# EAGLE design radar1 (EAGLE 8.7.1)
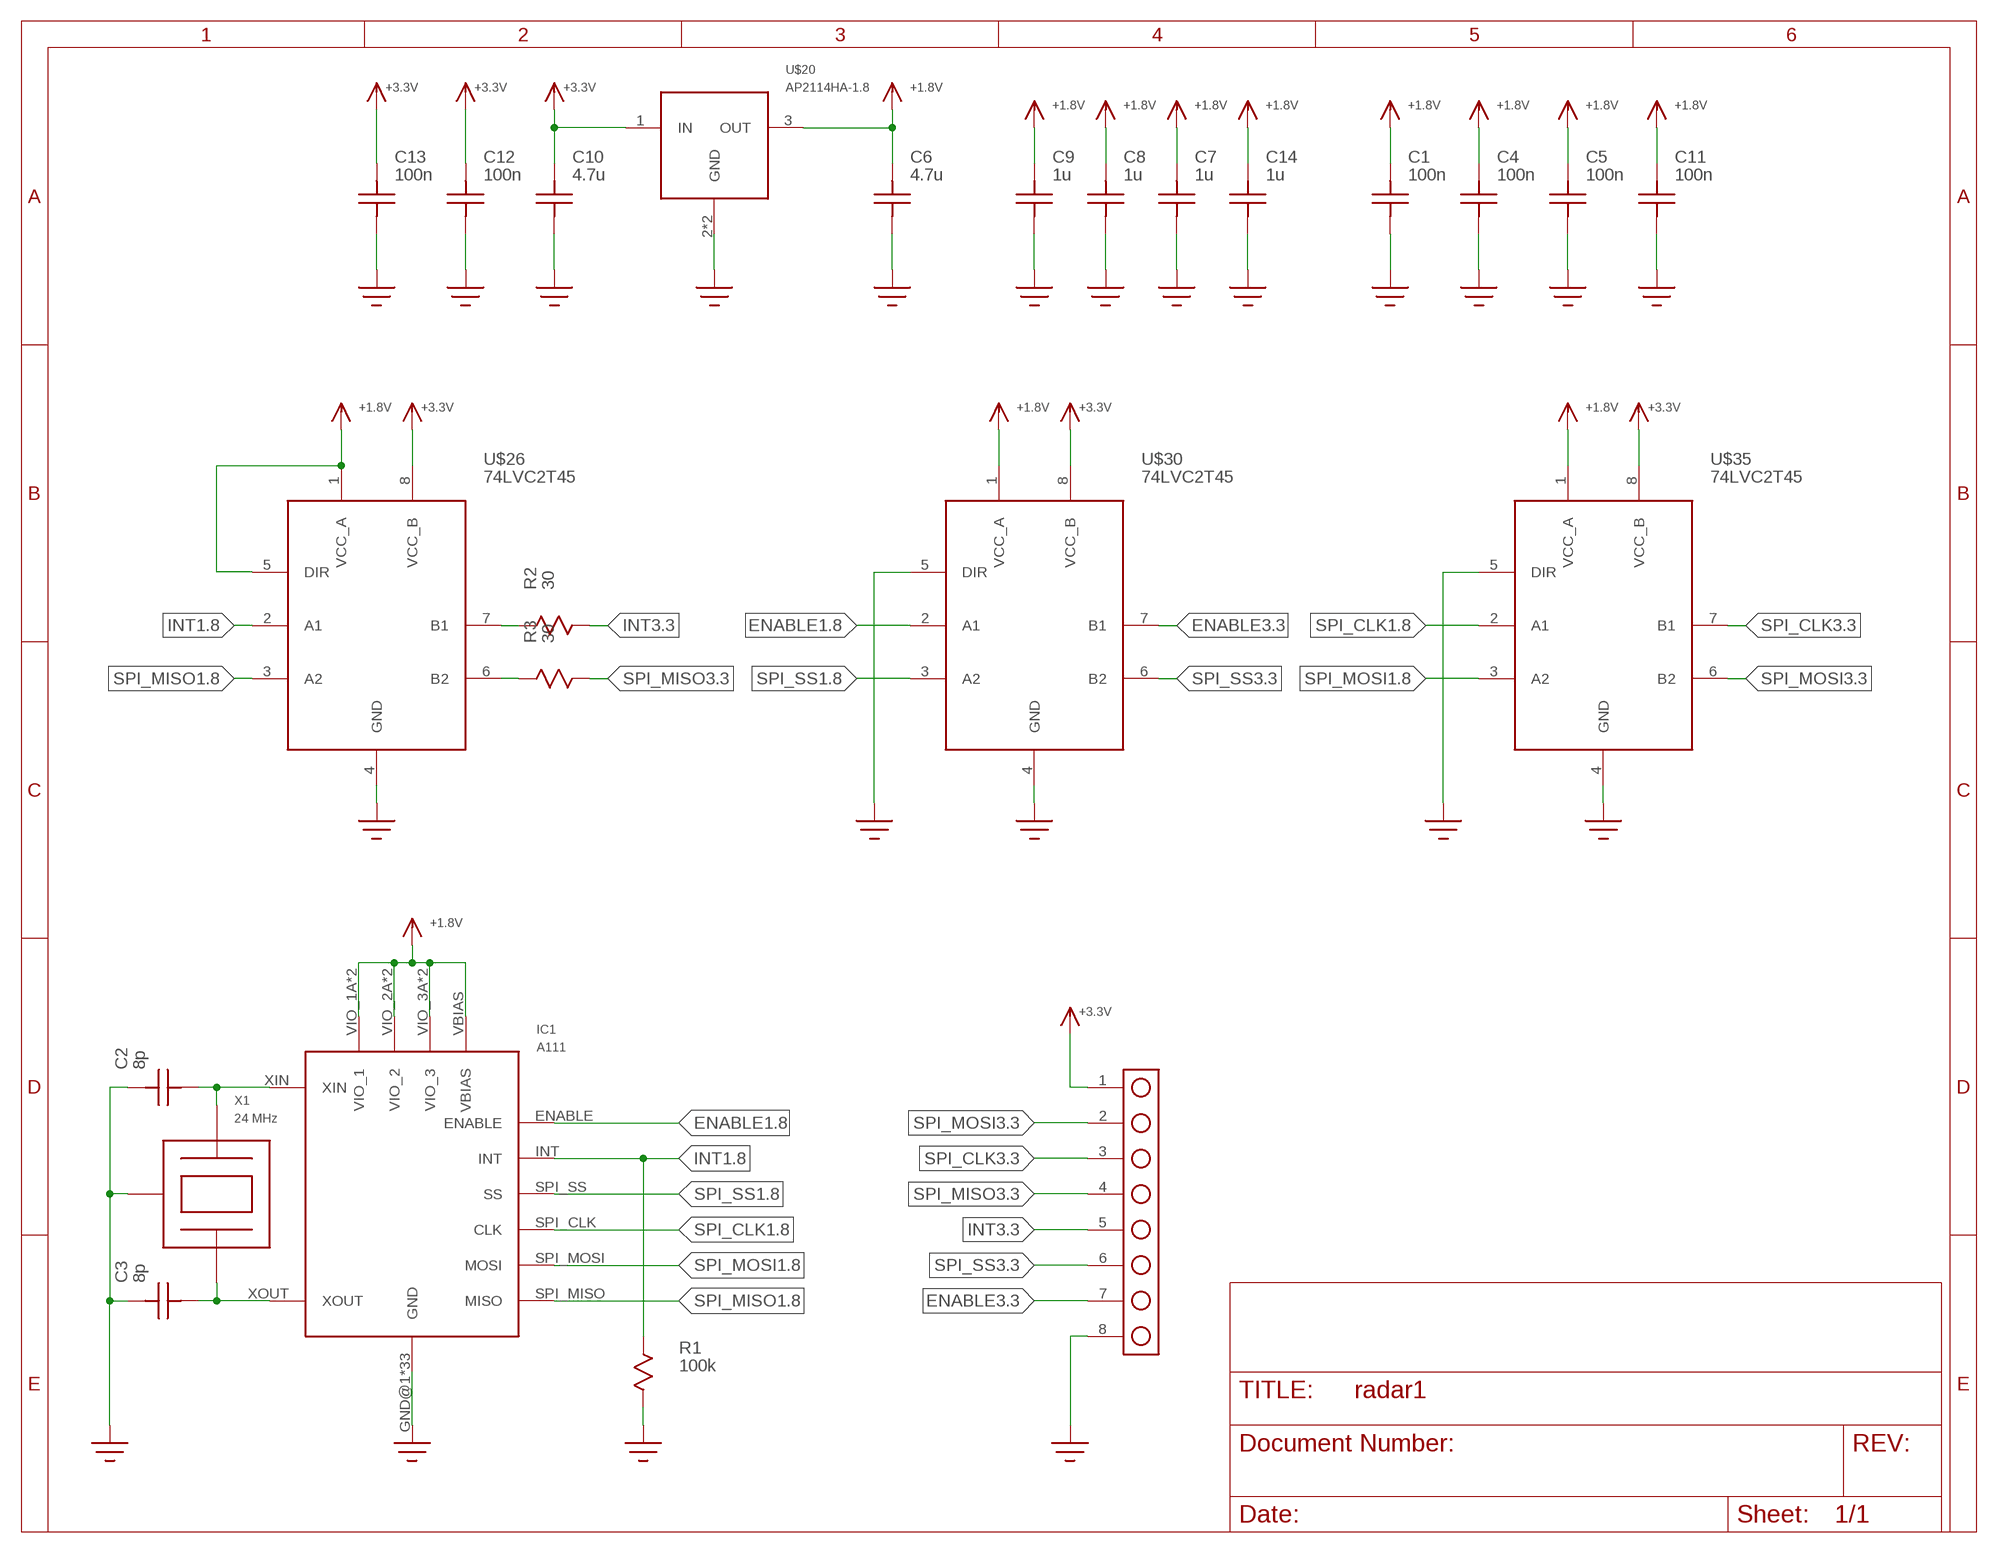
[diagram p0: schematic, sheet 1]

## Parts
C1  100n  C  [C0402]
C2  8p  C  [C0402]
C3  8p  C  [C0402]
C4  100n  C  [C0402]
C5  100n  C  [C0402]
C6  4.7u  C0603  [C0603]
C7  1u  C0603  [C0603]
C8  1u  C0603  [C0603]
C9  1u  C0603  [C0603]
C10  4.7u  C1206  [1206]
C11  100n  C  [C0402]
C12  100n  C  [C0402]
C13  100n  C  [C0402]
C14  1u  C0603  [C0603]
IC1  A111  [A111]
J1  HEADER_8_PIN  [HEADER_8_PIN]
R1  100k  R0603  [R0603]
R2  30  R0603  [R0603]
R3  30  R0603  [R0603]
U$20  AP2114HA-1.8  AP2114  [SOT-223]
U$26  74LVC2T45  [SM8]
U$30  74LVC2T45  [SM8]
U$35  74LVC2T45  [SM8]
X1  24 MHz  XTAL  [CRYSTAL_3.2X2.5]

## Nets
+1.8V: C1.2 C4.2 C5.2 C6.P$2 C7.P$2 C8.P$2 C9.P$2 C11.2 C14.P$2 IC1.VBIAS IC1.VIO_1A(VIO_1) IC1.VIO_1B(VIO_1) IC1.VIO_2A(VIO_2) IC1.VIO_2B(VIO_2) IC1.VIO_3A(VIO_3) IC1.VIO_3B(VIO_3) U$20.3(OUT) U$26.1(VCC_A) U$26.5(DIR) U$30.1(VCC_A) U$35.1(VCC_A)
+3.3V: C10.P$2 C12.2 C13.2 J1.1 U$20.1(IN) U$26.8(VCC_B) U$30.8(VCC_B) U$35.8(VCC_B)
ENABLE1.8: IC1.ENABLE U$30.2(A1)
ENABLE3.3: J1.7 U$30.7(B1)
GND: C1.1 C2.2 C3.2 C4.1 C5.1 C6.P$1 C7.P$1 C8.P$1 C9.P$1 C10.P$1 C11.1 C12.1 C13.1 C14.P$1 IC1.GND@1(GND) IC1.GND@2(GND) IC1.GND@3(GND) IC1.GND@4(GND) IC1.GND@5(GND) IC1.GND@6(GND) IC1.GND@7(GND) IC1.GND@8(GND) IC1.GND@9(GND) IC1.GND@10(GND) IC1.GND@11(GND) IC1.GND@12(GND) IC1.GND@13(GND) IC1.GND@14(GND) IC1.GND@15(GND) IC1.GND@16(GND) IC1.GND@17(GND) IC1.GND@18(GND) IC1.GND@19(GND) IC1.GND@20(GND) IC1.GND@21(GND) IC1.GND@22(GND) IC1.GND@23(GND) IC1.GND@24(GND) IC1.GND@25(GND) IC1.GND@26(GND) IC1.GND@27(GND) IC1.GND@28(GND) IC1.GND@29(GND) IC1.GND@30(GND) IC1.GND@31(GND) IC1.GND@32(GND) IC1.GND@33(GND) J1.8 R1.P$2 U$20.2(GND) U$20.4(GND) U$26.4(GND) U$30.4(GND) U$30.5(DIR) U$35.4(GND) U$35.5(DIR) X1.P$2(P$CASE) X1.P$4(P$CASE)
INT1.8: IC1.INT R1.P$1 U$26.2(A1)
INT3.3: J1.5 R2.P$2
N$3: C2.1 IC1.XIN X1.P$1(P$X1)
N$5: C3.1 IC1.XOUT X1.P$3(P$X2)
N$12: R2.P$1 U$26.7(B1)
N$17: R3.P$1 U$26.6(B2)
SPI_CLK1.8: IC1.SPI_CLK(CLK) U$35.2(A1)
SPI_CLK3.3: J1.3 U$35.7(B1)
SPI_MISO1.8: IC1.SPI_MISO(MISO) U$26.3(A2)
SPI_MISO3.3: J1.4 R3.P$2
SPI_MOSI1.8: IC1.SPI_MOSI(MOSI) U$35.3(A2)
SPI_MOSI3.3: J1.2 U$35.6(B2)
SPI_SS1.8: IC1.SPI_SS(SS) U$30.3(A2)
SPI_SS3.3: J1.6 U$30.6(B2)

## Library data of the parts
C1-C14 = a111:C
IC1 = a111:A111
J1 = a111:HEADER_8_PIN
R1-R3 = a111:R
U$20 = a111:AP2114
U$26 U$30 U$35 = a111:74LVC2T45
X1 = a111:XTAL

## Board
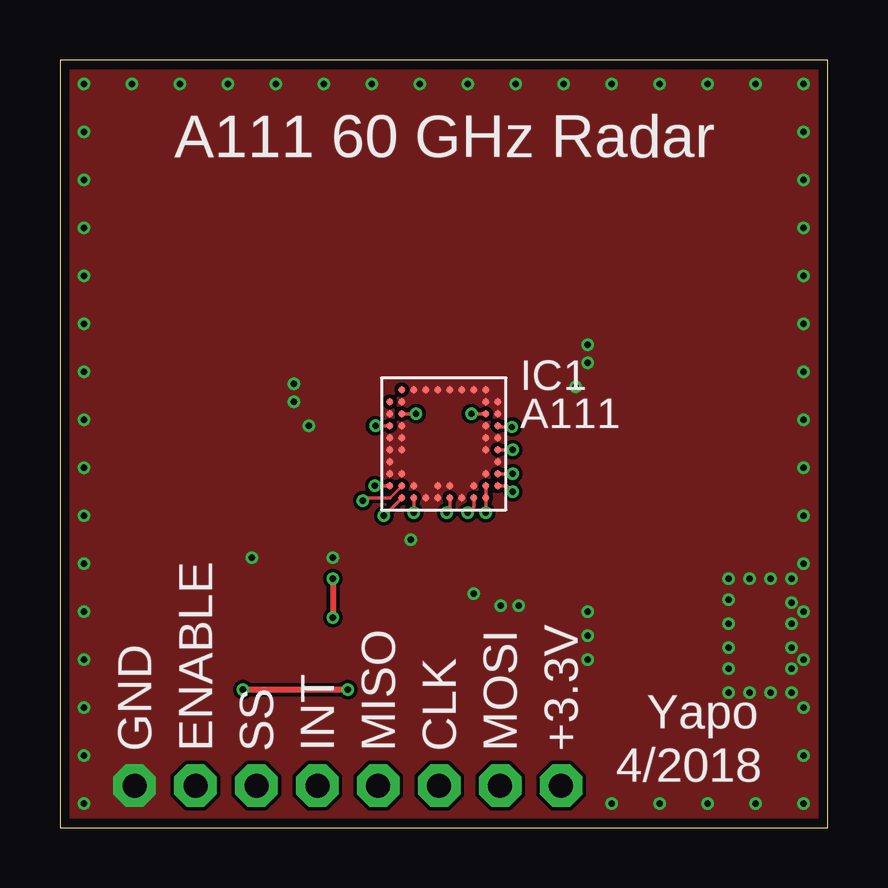
[diagram p1: board, top side]
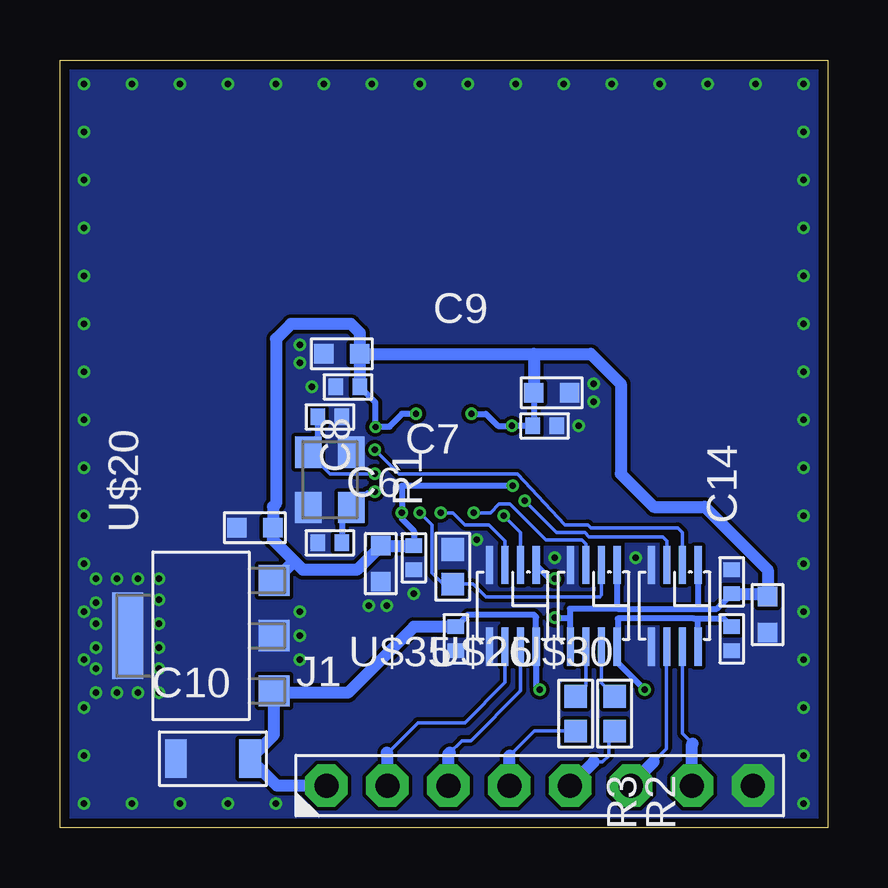
[diagram p2: board, bottom side, seen from below]

Size 32 x 32 mm. Coordinates in mm from the lower left corner, seen from the top.
Outline: 0,0 32,0 32,32 0,32 0,0
Copper layers (1*16): Top 0.035559375mm / dielectric 1.6mm / Bottom 0.035559375mm
Design rules "oshpark-2layer *": minimum track width 6mil, minimum drill 10mil, track to track 6mil, track to pad 6mil, pad to pad 6mil, via to via 6mil, smd to smd 6mil, copper to edge 15mil, drill to drill 6mil, minimum pad ring 5mil, minimum via ring 5mil, stop-mask expansion 2.5mil, vias tented up to drill 15mil, thermal gap 10mil

### Footprints (pad centres in the part's own frame; a part is rotated, then mirrored left to right if it is on the bottom)
C0402 = smd 0.6 x 0.7: 1 -0.5,0; 2 0.5,0
C0603 = smd 0.8 x 0.8: P$1 -0.75,0; P$2 0.75,0
1206 = smd 0.9 x 1.6: P$1 -1.55,0; P$2 1.55,0
A111 = smd 0.3 x 0.3: ENABLE 2.25,-0.25; GND@1 -1.25,2.25; GND@2 -0.75,2.25; GND@3 -0.25,2.25; GND@4 0.25,2.25; GND@5 0.75,2.25; GND@6 1.25,2.25; GND@7 1.75,2.25; GND@8 -1.75,1.75; GND@9 1.75,1.75; GND@10 2.25,1.75; GND@11 -2.25,1.25; GND@12 2.25,1.25; GND@13 -1.75,0.75; GND@14 1.75,0.75; GND@15 -2.25,0.25; GND@16 -1.75,0.25; GND@17 1.75,0.25; GND@18 2.25,0.25; GND@19 -2.25,-0.25; GND@20 -1.75,-0.25; GND@21 1.75,-0.25; GND@22 -2.25,-0.75; GND@23 2.25,-0.75; GND@24 -2.25,-1.25; GND@25 -1.75,-1.25; GND@26 1.75,-1.25; GND@27 -1.25,-1.75; GND@28 -0.25,-1.75; GND@29 0.25,-1.75; GND@30 1.25,-1.75; GND@31 -0.75,-2.25; GND@32 -0.25,-2.25; GND@33 0.75,-2.25; INT 1.25,-2.25; NC@1 -1.75,2.25; NC@2 -2.25,1.75; SPI_CLK -1.75,-2.25; SPI_MISO -1.25,-2.25; SPI_MOSI 0.25,-2.25; SPI_SS -1.75,-1.75; VBIAS -2.25,-1.75; VIO_1A -1.75,1.25; VIO_1B -2.25,0.75; VIO_2A 1.75,1.25; VIO_2B 2.25,0.75; VIO_3A 1.75,-1.75; VIO_3B 1.75,-2.25; XIN 2.25,-1.75; XOUT 2.25,-1.25
HEADER_8_PIN = drill 1 pad 1.778 octagon: 1 -8.89,0; 2 -6.35,0; 3 -3.81,0; 4 -1.27,0; 5 1.27,0; 6 3.81,0; 7 6.35,0; 8 8.89,0
R0603 = smd 0.95 x 0.95: P$1 -0.725,0; P$2 0.725,0
SOT-223 = smd 1.3 x 1.3: 1 -2.3,-3.05; 2 0,-3.05; 3 2.3,-3.05 | smd 3.6 x 1.3: 4 0,3.05
SM8 = smd 0.3 x 1.6: 1 -0.975,-1.7; 2 -0.325,-1.7; 3 0.325,-1.7; 4 0.975,-1.7; 5 0.975,1.7; 6 0.325,1.7; 7 -0.325,1.7; 8 -0.975,1.7
CRYSTAL_3.2X2.5 = smd 1.3 x 1.1: P$1 -1.15,-0.9; P$2 1.15,-0.9; P$3 1.15,0.9; P$4 -1.15,0.9

### Placement (x,y rotation side)
C1  11.8,16.75 180 bottom
C2  20.75,11.88 180 bottom
C3  20.75,17.12 0 bottom
C4  17.25,11.25 90 bottom
C5  20,18.38 0 bottom
C6  23.88,12.5 0 bottom
C7  11.5,18.12 180 bottom
C8  18.62,11 90 bottom
C9  20.25,19.75 0 bottom
C10  25.62,2.88 0 bottom
C11  4,10.25 270 bottom
C12  15.5,7.88 90 bottom
C13  4,7.88 90 bottom
C14  2.5,8.88 90 bottom
IC1  16,16 0 top
J1  12,1.75 0 bottom
R1  15.62,10.88 90 bottom
R2  8.88,4.75 270 bottom
R3  10.5,4.75 270 bottom
U$20  26.12,8 90 bottom
U$26  9.75,9.25 180 bottom
U$30  6.38,9.25 180 bottom
U$35  13.12,9.25 180 bottom
X1  20.75,14.5 90 bottom

### Tracks (layer width: path | path; a pad name or v marks a point on that pad's centre or on a via)
+1.8V  (via drill 0.25)
  Top 0.152: IC1.VIO_3A IC1.VIO_3B v17.75,13.12 | IC1.VBIAS v13.12,14.25 | IC1.VIO_2A v17.15,17.25 | v18.85,16.7 18.3,16.7 IC1.VIO_2B | IC1.VIO_1A v14.85,17.25 | v13.15,16.75 IC1.VIO_1B
  Top 0.254: v11.38,10.38 v11.38,8.75
  Bottom 0.152: IC1.VIO_2B 18.25,16.7
  Bottom 0.254: v13.12,14.25 IC1.VIO_3A v17.75,13.12 17.75,12.88 17.25,12.38 C4.2 | v17.15,17.25 IC1.VIO_2A IC1.VIO_2B | 18.25,16.7 v18.85,16.7 18.85,17.73 C5.2 | v14.85,17.25 IC1.VIO_1A IC1.VIO_1B v13.15,16.75 C1.2 12.25,16.8 C7.P$2 | 8.75,9.12 10.75,9.12 10.75,8.75 | 10.75,8.75 10.75,7.45 U$26.5 | U$26.1 8.78,9.15 8.75,9.12 | 8.75,9.12 5.38,9.12 | U$30.1 5.4,9.15 5.38,9.12 | 5.38,9.12 4.62,9.12 C11.2 | U$35.1 11.57,10.38 v11.38,10.38 | v11.38,8.75 10.75,8.75
  Bottom 0.508: C5.2 C9.P$2 | C9.P$2 12.25,19.75 | 12.25,19.75 C7.P$2 | C4.2 C8.P$2 19.62,10.75 21.88,10.75 22.25,11.12 | C9.P$2 19.5,20.62 19.88,21 22.38,21 23,20.38 23,13.5 23.12,13.38 C6.P$2 23.12,12 22.25,11.12 | C11.2 2.62,9.75 C14.P$2 2.5,10.75 5.12,13.38 7.25,13.38 8.62,14.75 8.62,18.5 9.88,19.75 12.25,19.75 | U$20.3 22.25,11.12
+3.3V  (via drill 0.25)
  Top 0.254: v12,5.75 v7.62,5.75
  Bottom 0.254: U$30.8 5.4,8.65 5.59,8.72 | 5.59,8.72 8.75,8.72 8.75,7.45 | 8.75,7.45 U$26.8 | C12.2 15,8.88 12.25,8.88 12.15,8.78 U$35.8 12.15,5.9 v12,5.75 | v7.62,5.75 8.75,6.88 8.75,7.45 | 5.59,8.72 4.34,8.72 C13.2
  Bottom 0.508: J1.1 22.95,1.75 C10.P$2 23.07,3.88 U$20.1 23,5.62 20,5.62 17.25,8.38 C12.2
ENABLE1.8  (via drill 0.25)
  Top 0.152: IC1.ENABLE v18.88,15.75
  Bottom 0.152: v18.88,15.75 17.86,14.73 12.93,14.73 10.94,12.62 10,12.62 9.88,12.5 6.25,12.5 6.05,12.3 U$30.2
ENABLE3.3
  Bottom 0.152: U$30.7 6.05,3.92 5.62,3.5
  Bottom 0.508: J1.7 5.65,3.48 5.62,3.5
GND  (via drill 0.25)
  other vias: 22,20.12 22,19.38 21.5,18.38 19.12,9.25 28.75,10.38 29.62,10.38 28.75,5.62 29.62,5.62 30.5,5.62 30.5,6.62 30.5,7.5 30.5,8.5 30.5,9.38 30.5,10.38 18.38,9.25 17.25,9.75 10.38,16.75 9.75,17.75 9.75,18.5 8,11.25 11.38,11.25 14.62,12 27.88,10.38 27.88,9.5 27.88,8.5 27.88,7.5 27.88,6.62 27.88,5.62 1,1 1,3 1,5 1,7 1,9 1,11 1,13 1,15 1,17 1,19 1,21 1,23 1,25 1,27 1,29 1,31 3,31 5,31 7,31 9,31 11,31 13,31 15,31 17,31 19,31 21,31 23,31 25,31 27,31 29,31 31,31 31,29 31,27 31,25 31,23 31,21 31,19 31,17 31,15 31,13 31,11 31,9 31,7 31,5 31,3 31,1 29,1 27,1 25,1 23,1 22,9 22,8 22,7
  pour Top (no thermals): 0,0 32.51,0 32.51,31.86 0,31.86
  pour Bottom (no thermals): 32.5,0 0,0 0,31.88 32.5,31.88
INT1.8  (via drill 0.25)
  Top 0.152: IC1.INT 17.25,13.38 v17,13.12
  Bottom 0.152: U$26.2 9.43,9.7 9.5,9.62 14.25,9.62 14.78,10.15 R1.P$1 16.02,10.15 16.5,10.62 16.5,12.62 v17,13.12
INT3.3
  Bottom 0.152: R2.P$2 9.12,3.77 9.12,3 9.39,2.73 9.75,2.73
  Bottom 0.508: J1.5 9.75,2.73 9.75,2.75
N$3  (via drill 0.25)
  Top 0.152: IC1.XIN 18.62,14.25 v18.88,14
  Bottom 0.152: v18.88,14 19.2,14 X1.P$1
  Bottom 0.254: X1.P$1 20.25,12.95 C2.1
N$5  (via drill 0.25)
  Top 0.152: IC1.XOUT v18.88,14.75
  Bottom 0.152: v18.88,14.75 20.75,14.75 X1.P$3
  Bottom 0.254: X1.P$3 21.25,16.05 C3.1
N$12
  Bottom 0.152: U$26.7 9.43,6.03 R2.P$1
N$17
  Bottom 0.152: U$26.6 10.07,5.9 R3.P$1
SPI_CLK1.8  (via drill 0.25)
  Top 0.152: IC1.SPI_CLK v13.5,13
  Bottom 0.152: v13.5,13 12.8,12.3 U$35.2
SPI_CLK3.3
  Bottom 0.152: U$35.7 12.8,5.7 14.88,3.62 15.25,3.62 15.81,3.06
  Bottom 0.508: J1.3 15.81,3.06 15.75,3.12
SPI_MISO1.8  (via drill 0.25)
  Top 0.152: IC1.SPI_MISO v14.75,13.12
  Bottom 0.152: v14.75,13.12 14.06,13.12 13.7,13.48 13.23,13.48 11.75,12 10.25,12 10.07,11.82 U$26.3
SPI_MISO3.3
  Bottom 0.152: 13.27,2.98 12.22,4.03 R3.P$2
  Bottom 0.508: J1.4 13.27,2.98 13.25,3
SPI_MOSI1.8  (via drill 0.25)
  Top 0.152: IC1.SPI_MOSI 16.25,13.25 v16.12,13.12
  Bottom 0.152: v16.12,13.12 15.62,13.12 15.12,12.62 14.12,12.62 13.45,11.95 U$35.3
SPI_MOSI3.3
  Bottom 0.152: U$35.6 13.45,6.05 15.12,4.38 17.07,4.38 18.35,3.1
  Bottom 0.508: J1.2 18.35,3.1 18.38,3.12
SPI_SS1.8  (via drill 0.25)
  Top 0.127: IC1.SPI_SS 13.75,13.75
  Top 0.152: 13.75,13.75 12.75,13.75 v12.62,13.62
  Bottom 0.152: v12.62,13.62 11.3,12.3 10.12,12.3 9.94,12.12 6.88,12.12 6.7,11.95 U$30.3
SPI_SS3.3
  Bottom 0.152: U$30.6 6.72,7.53 6.72,3.28 7.25,2.75
  Bottom 0.508: J1.6 8.19,1.81 7.25,2.75

### Text on the board
tPlace: A111 60 GHz Radar | Yapo | GND | ENABLE | SS | INT | MISO | CLK | MOSI | +3.3V | 4/2018